# EAGLE design TXTempus (EAGLE 9.6.2)
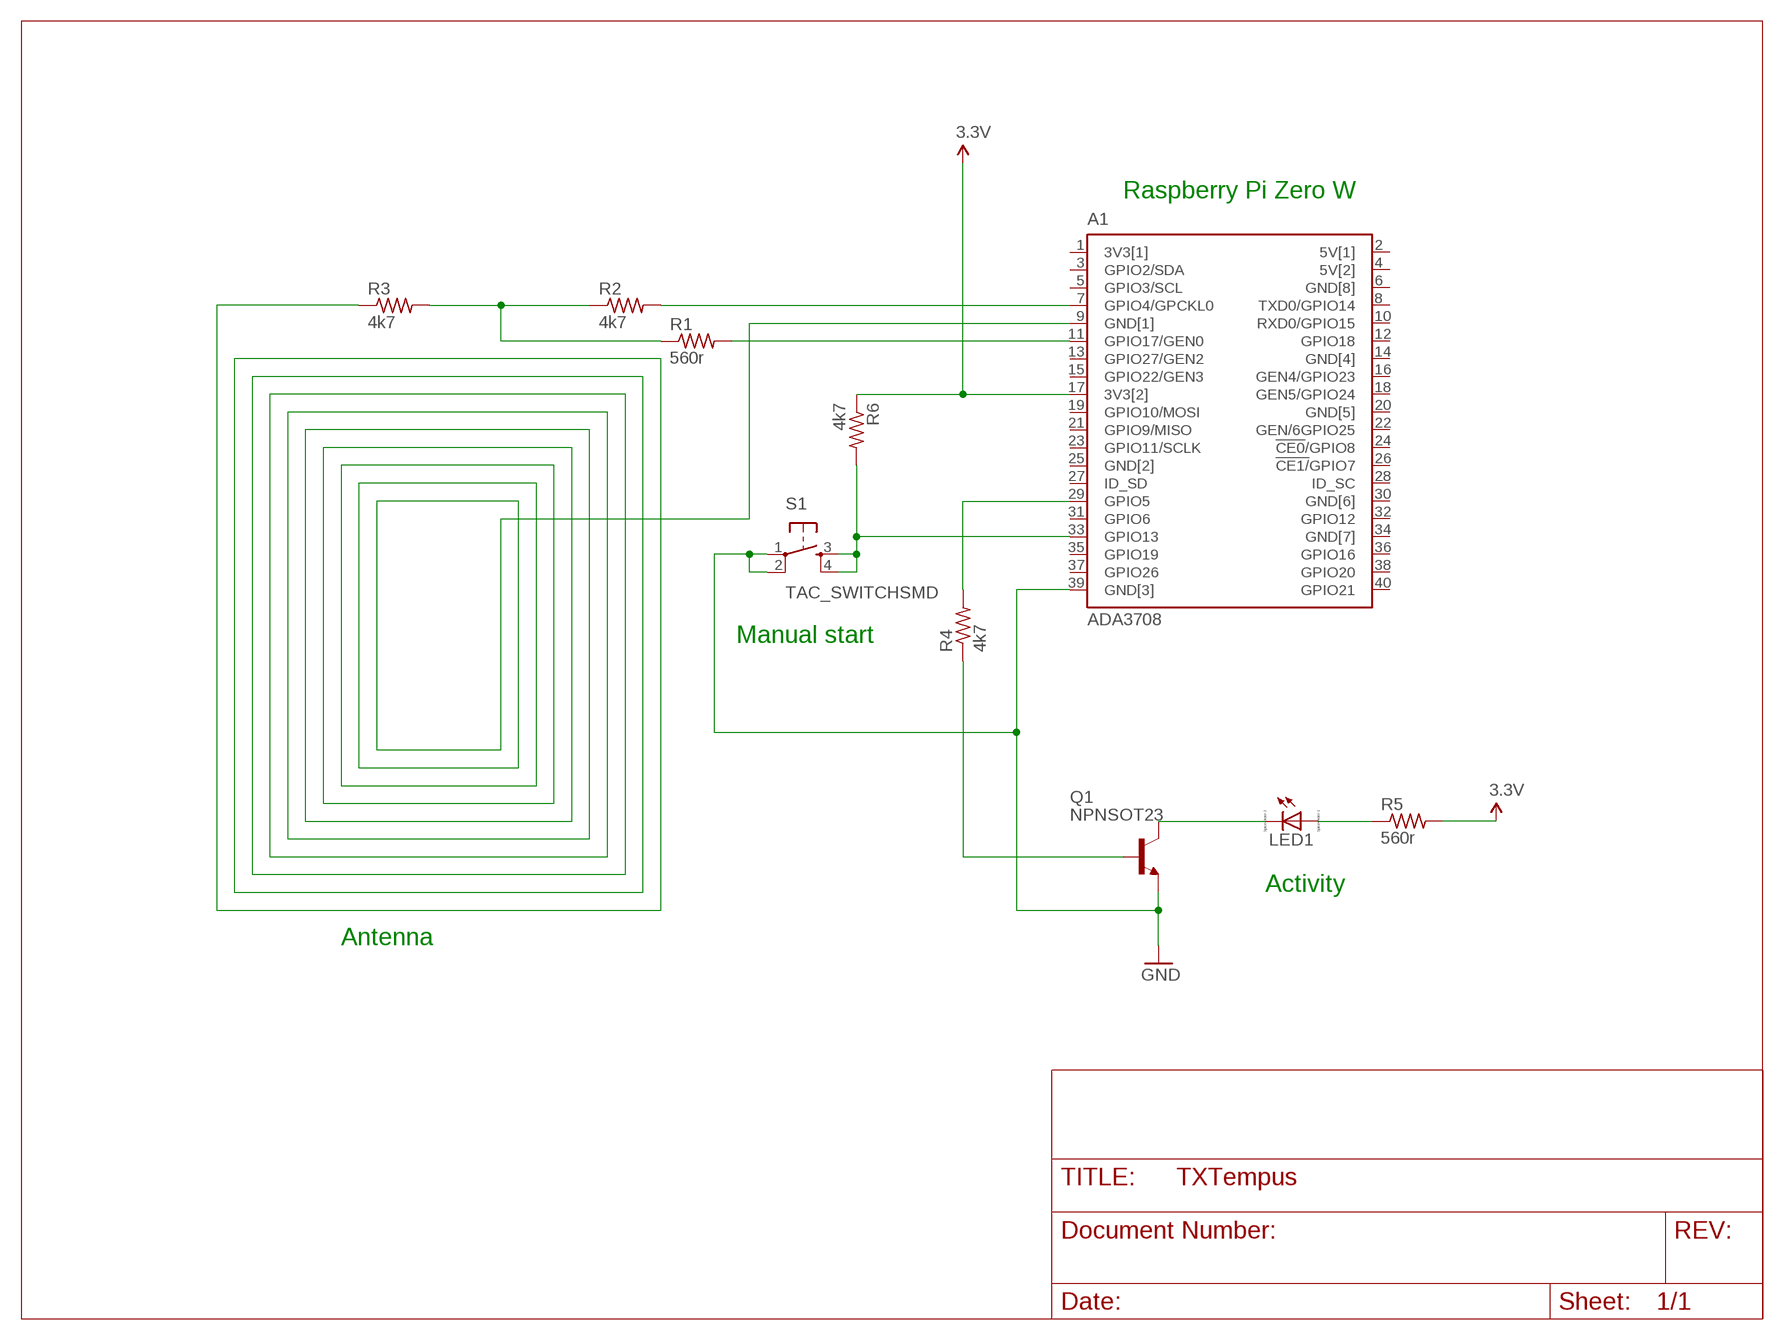
[diagram p0: schematic, sheet 1]

## Parts
A1  ADA3708  [ADA3708_RPI-ZERO]
LED1  LED_E  [LED_1206]
Q1  NPNSOT23  [SOT23]
R1  560r  R-US_M0805  [M0805]
R2  4k7  R-US_M0805  [M0805]
R3  4k7  R-US_M0805  [M0805]
R4  4k7  R-US_M0805  [M0805]
R5  560r  R-US_M0805  [M0805]
R6  4k7  R-US_M0805  [M0805]
S1  TAC_SWITCHSMD  [TACTILE-SWITCH-SMD]

## Nets
3.3V: A1.17(3V3[2]) R5.2 R6.1
GND: A1.39(GND[3]) Q1.2(E) S1.1 S1.2
N$1: A1.11(GPIO17/GEN0) R1.2
N$2: A1.7(GPIO4/GPCKL0) R2.2
N$3: R1.1 R2.1 R3.2
N$4: A1.9(GND[1]) R3.1
N$5: A1.29(GPIO5) R4.2
N$6: Q1.1(B) R4.1
N$7: LED1.C Q1.3(C)
N$8: LED1.A R5.1
N$9: A1.33(GPIO13) R6.2 S1.3 S1.4
Unconnected: A1.3(GPIO2/SDA) A1.5(GPIO3/SCL) A1.8(TXD0/GPIO14) A1.10(RXD0/GPIO15) A1.12(GPIO18) A1.13(GPIO27/GEN2) A1.15(GPIO22/GEN3) A1.16(GEN4/GPIO23) A1.18(GEN5/GPIO24) A1.19(GPIO10/MOSI) A1.21(GPIO9/MISO) A1.22(GEN/6GPIO25) A1.23(GPIO11/SCLK) A1.24(!CE0!/GPIO8) A1.26(!CE1/!GPIO7) A1.27(ID_SD) A1.28(ID_SC) A1.31(GPIO6) A1.32(GPIO12) A1.35(GPIO19) A1.36(GPIO16) A1.37(GPIO26) A1.38(GPIO20) A1.40(GPIO21)

## Notes on the sheet
- Raspberry Pi Zero W
- Manual start
- Activity
- Antenna

## Power pins joined to a net without a drawn wire
3V3[1]: A1.1(3V3[1])
5V[1]: A1.2(5V[1])
5V[2]: A1.4(5V[2])
GND[2]: A1.25(GND[2])
GND[4]: A1.14(GND[4])
GND[5]: A1.20(GND[5])
GND[6]: A1.30(GND[6])
GND[7]: A1.34(GND[7])
GND[8]: A1.6(GND[8])

## Library data of the parts
A1 = ADA3708:ADA3708: Raspberry Pi Zero WH (Zero W with Headers); AVAILABILITY: Unavailable; DESCRIPTION: Raspberry Pi Zero WH _Zero W with Headers_; MF: Raspberry Pi; MP: ADA3708; PACKAGE: None; PRICE: None
LED1 = eagle-ltspice:LED_E: LED Source: http://www.osram.convergy.de Source: www.luxeon.com Source: www.kingbright.com; SPICEMODEL: NONE; SPICEPREFIX: D; SPICETYPE: diode
Q1 = Jim:NPN: NPN Transistor
R1-R6 = rcl:R-US_: RESISTOR, American symbol
S1 = SparkFun-Retired:TAC_SWITCH: Momentary Switch Button commonly used for reset or general input. Spark Fun Electronics SKU : COM-00097 SMT- SWCH-08247; PROD_ID: SWCH-08247

## Board
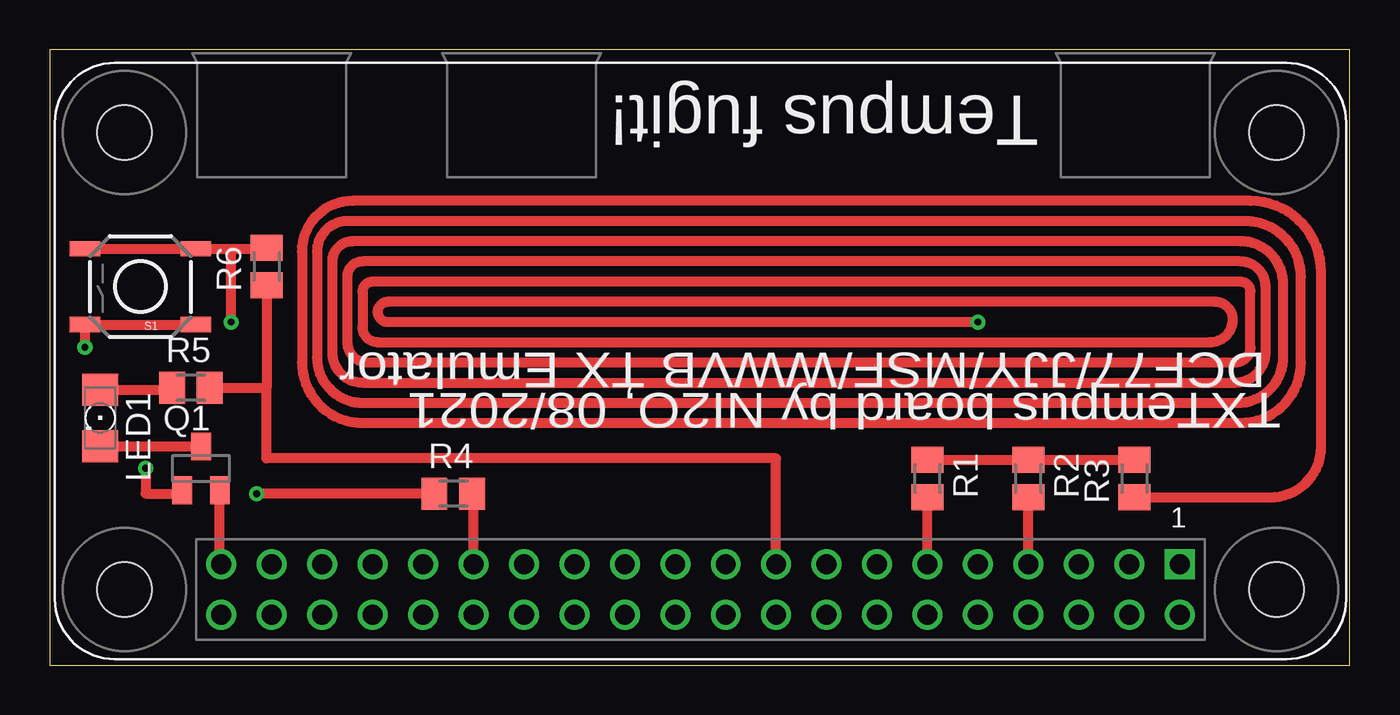
[diagram p1: board, top side]
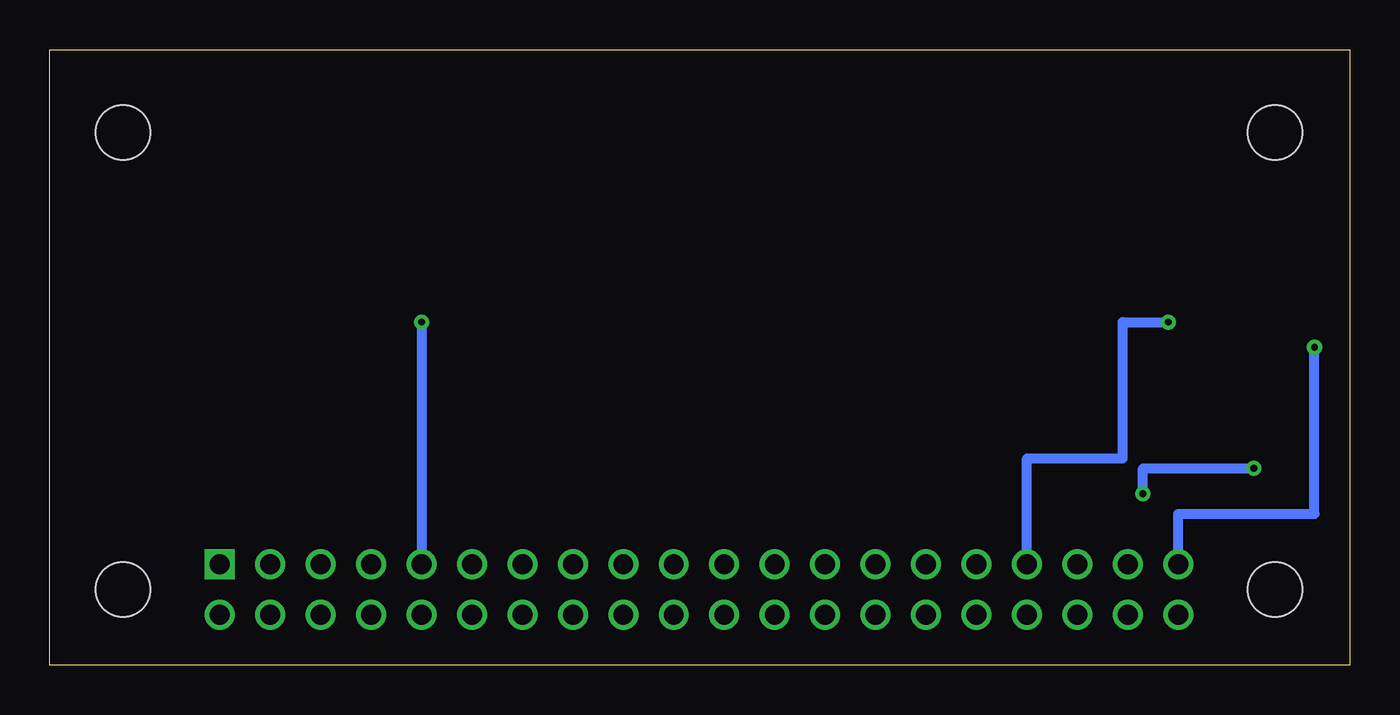
[diagram p2: board, bottom side, seen from below]

Size 65.46 x 30.98 mm. Coordinates in mm from the lower left corner, seen from the top.
Outline: 0,0 65.46,0 65.46,30.98 0,30.98 0,0
Copper layers (1*16): Top 0.035mm / dielectric 1.5mm / Bottom 0.035mm
Design rules "default": minimum track width 10mil, minimum drill 24mil, track to track 8mil, track to pad 8mil, pad to pad 8mil, via to via 8mil, smd to smd 8mil, copper to edge 40mil, drill to drill 8mil, minimum pad ring 10mil, minimum via ring 8mil, stop-mask expansion 4mil, vias tented up to drill 0mil, thermal gap 10mil

### Footprints (pad centres in the part's own frame; a part is rotated, then mirrored left to right if it is on the bottom)
ADA3708_RPI-ZERO = drill 1 square: 1 -24.13,-1.27 | drill 1: 2 -24.13,1.27; 3 -21.59,-1.27; 4 -21.59,1.27; 5 -19.05,-1.27; 6 -19.05,1.27; 7 -16.51,-1.27; 8 -16.51,1.27; 9 -13.97,-1.27; 10 -13.97,1.27; 11 -11.43,-1.27; 12 -11.43,1.27; 13 -8.89,-1.27; 14 -8.89,1.27; 15 -6.35,-1.27; 16 -6.35,1.27; 17 -3.81,-1.27; 18 -3.81,1.27; 19 -1.27,-1.27; 20 -1.27,1.27; 21 1.27,-1.27; 22 1.27,1.27; 23 3.81,-1.27; 24 3.81,1.27; 25 6.35,-1.27; 26 6.35,1.27; 27 8.89,-1.27; 28 8.89,1.27; 29 11.43,-1.27; 30 11.43,1.27; 31 13.97,-1.27; 32 13.97,1.27; 33 16.51,-1.27; 34 16.51,1.27; 35 19.05,-1.27; 36 19.05,1.27; 37 21.59,-1.27; 38 21.59,1.27; 39 24.13,-1.27; 40 24.13,1.27 | hole 2.75: -29,-23; -29,0; 29,-23; 29,0
LED_1206 = smd 1.6 x 1.803: A -1.422,0; C 1.422,0
SOT23 = smd 1 x 1.4: 1 -0.95,-1.1; 2 0.95,-1.1; 3 0,1.1
M0805 = smd 1.3 x 1.6: 1 -0.95,0; 2 0.95,0
TACTILE-SWITCH-SMD = smd 1.524 x 0.762: 1 -2.794,1.905; 2 2.794,1.905; 3 -2.794,-1.905; 4 2.794,-1.905

### Placement (x,y rotation side)
A1  32.77,3.81 180 top
LED1  2.54,12.45 270 top
Q1  7.62,9.91 0 top
R1  44.2,9.4 270 top
R2  49.28,9.4 270 top
R3  54.61,9.4 90 top
R4  20.32,8.64 0 top
R5  7.11,13.97 0 top
R6  10.92,20.07 90 top
S1  4.57,19.05 180 top

### Tracks (layer width: path | path; a pad name or v marks a point on that pad's centre or on a via)
3.3V
  Top 0.508: 8.38,13.97 R5.2 10.92,13.97 | A1.17 36.58,10.41 10.92,10.41 10.92,13.97 | R6.1 10.92,13.97
GND  (via drill 0.35)
  Top 0.508: A1.39 arc-90 8.57,5.15 Q1.2 | S1.1 S1.2 v1.78,16
  Bottom 0.508: A1.39 8.64,7.62 1.78,7.62 v1.78,16
N$1
  Top 0.508: A1.11 R1.2
N$2
  Top 0.508: A1.7 R2.2
N$3
  Top 0.508: R1.1 R2.1 R3.2
N$4  (via drill 0.35)
  Top 0.508: R3.1 61.47,8.45 arc90 64.01,10.99 64.01,19.81 arc90 60.45,23.37 15.24,23.37 arc90 12.7,20.83 12.7,15.24 arc90 15.75,12.19 59.94,12.19 arc90 62.99,15.24 62.99,19.56 arc90 60.2,22.35 14.99,22.35 arc90 13.46,20.83 13.46,15.49 arc90 15.75,13.21 59.82,13.21 arc90 62.1,15.49 62.1,19.18 arc90 59.94,21.34 15.24,21.34 arc90 14.22,20.32 14.22,15.75 arc90 15.75,14.22 59.69,14.22 arc90 61.21,15.75 61.21,19.05 arc90 59.94,20.32 15.75,20.32 arc90 14.99,19.56 14.99,16.26 arc90 16,15.24 59.69,15.24 arc90 60.45,16 60.45,18.8 arc90 59.94,19.3 16.26,19.3 arc90 15.75,18.8 15.75,17.02 arc90 16.51,16.26 58.42,16.26 arc90 59.56,17.4 arc90 58.67,18.29 17.02,18.29 arc90 16.51,17.78 arc90 17.02,17.27 v46.74,17.27
  Bottom 0.508: v46.74,17.27 A1.9
N$5
  Top 0.508: A1.29 21.34,8.57 arc90 R4.2
N$6  (via drill 0.35)
  Top 0.508: R4.1 v10.41,8.64 | v4.83,9.91 4.83,8.64 6.67,8.64 Q1.1
  Bottom 0.508: v4.83,9.91 10.41,9.91 v10.41,8.64
N$7
  Top 0.508: Q1.3 2.56,11.01 arc-90 LED1.C
N$8
  Top 0.508: LED1.A 6.06,13.87 arc90 R5.1
N$9  (via drill 0.35)
  Top 0.508: S1.4 S1.3 9.14,20.95 | 9.14,20.95 10.86,20.95 arc90 R6.2 | v9.14,17.27 9.14,20.95
  Bottom 0.508: A1.33 16.26,10.41 11.43,10.41 11.43,17.27 v9.14,17.27

### Text on the board
tNames: Tempus fugit! | DCF77/JJY/MSF/WWVB TX Emulator | TXTempus board by NI2O, 08/2021